# EAGLE schematic TRANS (EAGLE 8.1.1)
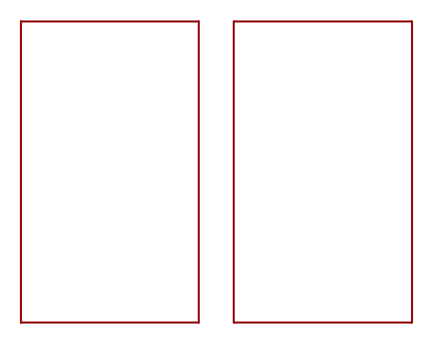
[diagram p0: schematic, sheet 1]

## Parts
U$1  SIMENTR  [TRANS]
U$2  SIMENTR  [TRANS]

## Library data of the parts
U$1 U$2 = Vwvwbg:SIMENTR